# Altium schematic sheet HEADER_1.SchDoc
size 420 x 297 mm; Revision: V1.2.1; SheetNumber: 2; SheetTotal: 12
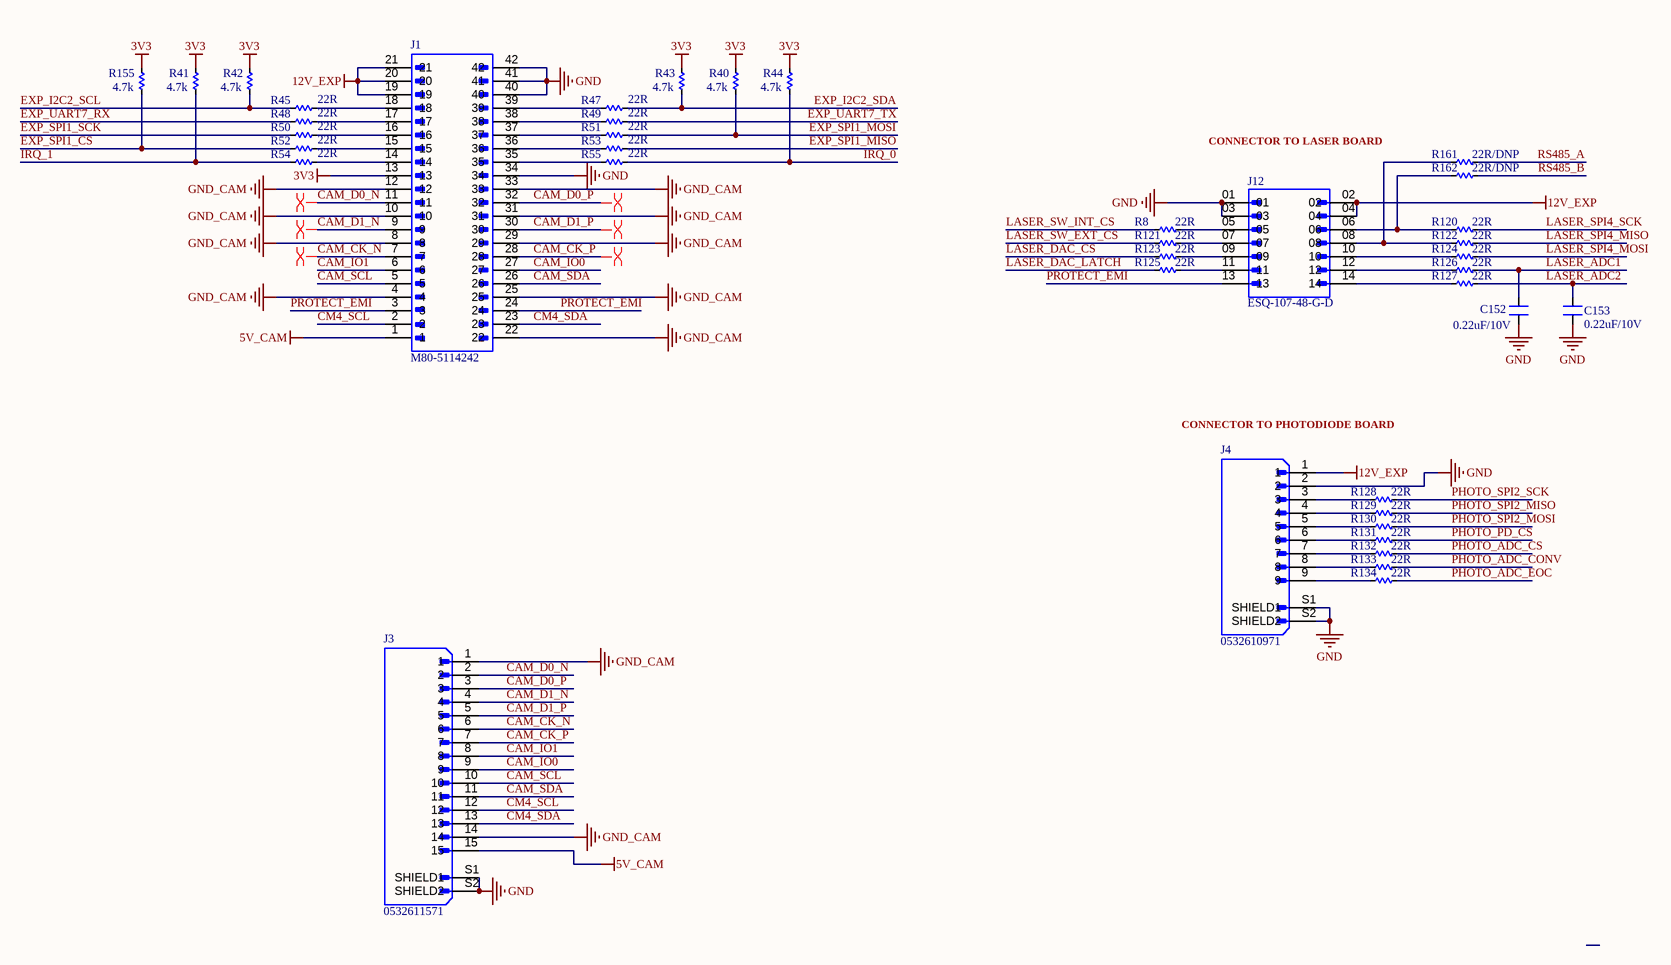
[diagram p0: HEADER_1.SchDoc]

## Parts
C152  0.22uF/10V  [CAP_C_1608X80]
C153  0.22uF/10V  [CAP_C_1608X80]
J1  M80-5114242  [M80-5114242]
J3  0532611571  [0532611571]
J4  0532610971  [0532610971]
J12  ESQ-107-48-G-D  [ESQ-107-37-G-D]
R8  22R  [RES_C_1608X60]
R40  4.7k  [RES_C_1608X60]
R41  4.7k  [RES_C_1608X60]
R42  4.7k  [RES_C_1608X60]
R43  4.7k  [RES_C_1608X60]
R44  4.7k  [RES_C_1608X60]
R45  22R  [RES_C_1608X60]
R47  22R  [RES_C_1608X60]
R48  22R  [RES_C_1608X60]
R49  22R  [RES_C_1608X60]
R50  22R  [RES_C_1608X60]
R51  22R  [RES_C_1608X60]
R52  22R  [RES_C_1608X60]
R53  22R  [RES_C_1608X60]
R54  22R  [RES_C_1608X60]
R55  22R  [RES_C_1608X60]
R120  22R  [RES_C_1608X60]
R121  22R  [RES_C_1608X60]
R122  22R  [RES_C_1608X60]
R123  22R  [RES_C_1608X60]
R124  22R  [RES_C_1608X60]
R125  22R  [RES_C_1608X60]
R126  22R  [RES_C_1608X60]
R127  22R  [RES_C_1608X60]
R128  22R  [RES_C_1608X60]
R129  22R  [RES_C_1608X60]
R130  22R  [RES_C_1608X60]
R131  22R  [RES_C_1608X60]
R132  22R  [RES_C_1608X60]
R133  22R  [RES_C_1608X60]
R134  22R  [RES_C_1608X60]
R155  4.7k  [RES_C_1608X60]
R161  22R/DNP  [RES_C_1608X60]
R162  22R/DNP  [RES_C_1608X60]

## Nets
3V3: J1.13 R40.1 R41.1 R42.1 R43.1 R44.1 R155.1
5V_CAM: J1.1 J3.15
12V_EXP: J1.19 J1.20 J1.21 J4.1 J12.02 J12.04
GND: C152.1 C153.1 J1.34 J1.40 J1.41 J1.42 J3.S1(SHIELD1) J3.S2(SHIELD2) J4.2 J4.S1(SHIELD1) J4.S2(SHIELD2) J12.01 J12.03
GND_CAM: J1.4 J1.8 J1.10 J1.12 J1.22 J1.25 J1.29 J1.31 J1.33 J3.1 J3.14
CAM_CK_N: J1.7 J3.6
CAM_CK_P: J1.28 J3.7
CAM_D0_N: J1.11 J3.2
CAM_D0_P: J1.32 J3.3
CAM_D1_N: J1.9 J3.4
CAM_D1_P: J1.30 J3.5
CAM_IO0: J1.27 J3.9
CAM_IO1: J1.6 J3.8
CAM_SCL: J1.5 J3.10
CAM_SDA: J1.26 J3.11
CM4_SCL: J1.2 J3.12
CM4_SDA: J1.23 J3.13
EXP_I2C2_SCL: R42.2 R45.1
EXP_I2C2_SDA: R43.2 R47.2
EXP_SPI1_CS: R52.1 R155.2
EXP_SPI1_MISO: R53.2
EXP_SPI1_MOSI: R40.2 R51.2
EXP_SPI1_SCK: R50.1
EXP_UART7_RX: R48.1
EXP_UART7_TX: R49.2
IRQ_0: R44.2 R55.2
IRQ_1: R41.2 R54.1
LASER_ADC1: C152.2 R126.2
LASER_ADC2: C153.2 R127.2
LASER_DAC_CS: R123.1
LASER_DAC_LATCH: R125.1
LASER_SPI4_MISO: R122.2
LASER_SPI4_MOSI: R124.2
LASER_SPI4_SCK: R120.2
LASER_SW_EXT_CS: R121.1
LASER_SW_INT_CS: R8.1
PHOTO_ADC_CONV: R133.2
PHOTO_ADC_CS: R132.2
PHOTO_ADC_EOC: R134.2
PHOTO_PD_CS: R131.2
PHOTO_SPI2_MISO: R129.2
PHOTO_SPI2_MOSI: R130.2
PHOTO_SPI2_SCK: R128.2
PROTECT_EMI: J1.3 J1.24 J12.13
RS485_A: R161.2
RS485_B: R162.2
NetJ1_14: J1.14 R54.2
NetJ1_15: J1.15 R52.2
NetJ1_16: J1.16 R50.2
NetJ1_17: J1.17 R48.2
NetJ1_18: J1.18 R45.2
NetJ1_35: J1.35 R55.1
NetJ1_36: J1.36 R53.1
NetJ1_37: J1.37 R51.1
NetJ1_38: J1.38 R49.1
NetJ1_39: J1.39 R47.1
NetJ4_3: J4.3 R128.1
NetJ4_4: J4.4 R129.1
NetJ4_5: J4.5 R130.1
NetJ4_6: J4.6 R131.1
NetJ4_7: J4.7 R132.1
NetJ4_8: J4.8 R133.1
NetJ4_9: J4.9 R134.1
NetJ12_05: J12.05 R8.2
NetJ12_06: J12.06 R120.1 R162.1
NetJ12_07: J12.07 R121.2
NetJ12_08: J12.08 R122.1 R161.1
NetJ12_09: J12.09 R123.2
NetJ12_10: J12.10 R124.1
NetJ12_11: J12.11 R125.2
NetJ12_12: J12.12 R126.1
NetJ12_14: J12.14 R127.1

## Layout directives
differential pair; differential pair class DIF100: CAM_CK_N, CAM_CK_P, CAM_D0_N, CAM_D0_P, CAM_D1_N, CAM_D1_P

## Notes on the sheet
- CONNECTOR TO LASER BOARD
- (near J4) CONNECTOR TO PHOTODIODE BOARD
- Project:
- BEE-PC1
- Sub-system:
- NANORACK_EXP_CONTROLLER
- Design by:
- SANG HUYNH
- BAO BUI Q.
- Sheet title:
- Sheet
- A3
- of
- Checked by:
- Approved by:
- VU PHAM
- Revision:
- Document No:
- Size:
- Date:

## Library data of the parts
C152 C153 = Capacitors: Value: 33pF
J1 = CONN_TH_42: CONN HEADER VERT 42POS 2MM
J3 = CONN_SMD_15: Conn Shrouded Header (4 Sides) HDR 15 POS 1.25mm Solder RA Side Entry SMD PicoBladeâ„¢ T/R; MF: Molex; Package: None; MP: 532611571; Check_prices: https://www.snapeda.com/parts/532611571/Molex/view-part/?ref=eda; Purchase-URL: https://pricing.snapeda.com/search/part/532611571/?ref=eda; Value: *; Availability: In Stock; Price: None; SnapEDA_Link: https://www.snapeda.com/parts/532611571/Molex/view-part/?ref=snap
J4 = CONN_SMD_09: CONN HEADER SMD R/A 9POS 1.25MM
J12 = CONN_TH_14: CONN SOCKET 14POS 0.1 GOLD PCB
R8 R40-R45 R47-R55 R120-R134 R155 R161 R162 = Res SMD: SMD; Manufacturer: Generic Components; Class: Passive; Published: 08/06/2000; Publisher: Altium Hobart Technology Centre